# EAGLE design BoardA2 (EAGLE 8.2.1)
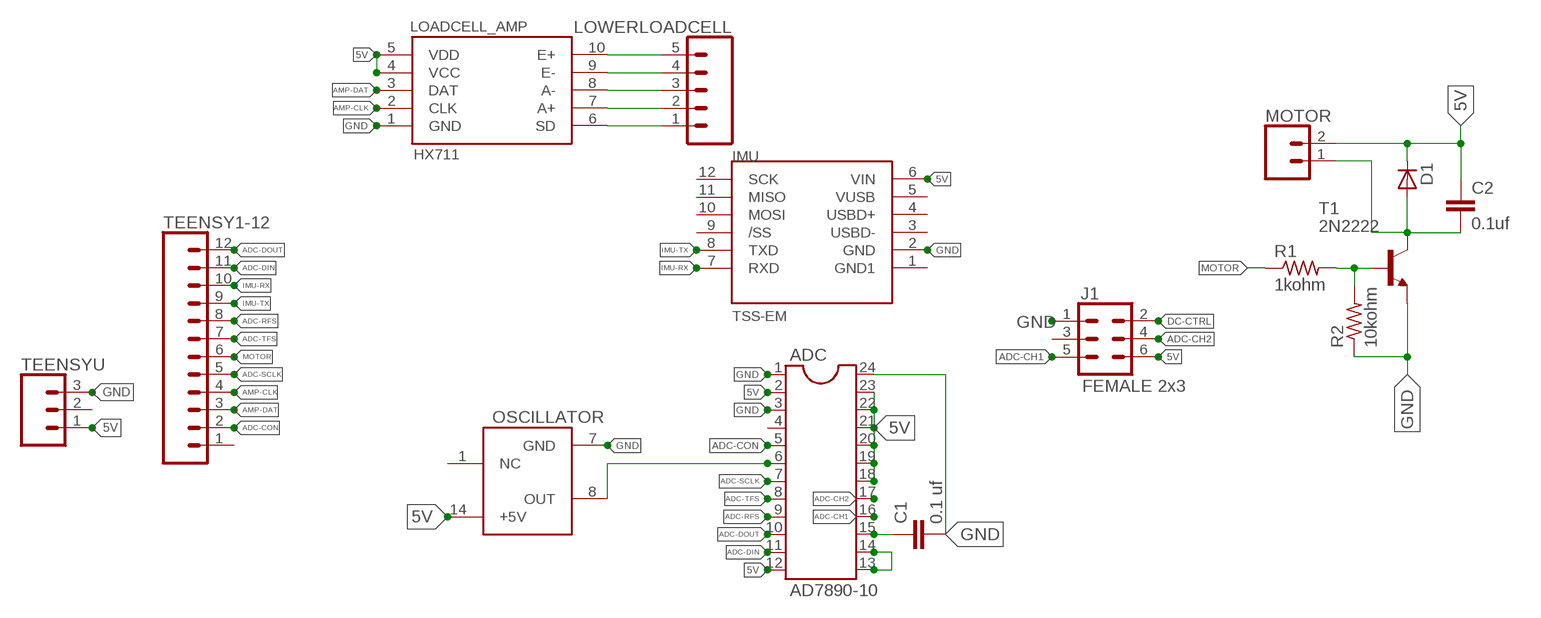
[diagram p0: schematic, sheet 1]

## Parts
ADC  AD7890-10  DIL24-3  [DIL24-3]
C1  0.1 uf  C5/2.5  [C5B2.5]
C2  0.1uf  C5/2.5  [C5B2.5]
D1  DIODE_E-DO35-7  [DIODE_DO35-7]
IMU  TSS-EM  IMU  [IMU]
J1  FEMALE 2x3  CONN_03X2FEMALE  [2X3]
LOADCELL_AMP  HX711  LOADCELLAMP  [LOADCELLAMP2]
LOWERLOADCELL  CONN_05  [1X05]
MOTOR  CONN_02  [1X02]
OSCILLATOR  CLOCK-ECS-100X  [ECS-100X]
R1  1kohm  R-US_0204/5  [0204/5]
R2  10kohm  R-US_0204/5  [0204/5]
T1  2N2222  [TO18]
TEENSY1-12  CONN_12  [1X12]
TEENSYU  CONN_03  [1X03]

## Nets
5V: ADC.2 ADC.12 ADC.18 ADC.19 ADC.20 ADC.21 ADC.22 ADC.23 C2.1 D1.C(A) IMU.6(VIN) J1.6 LOADCELL_AMP.4(VCC) LOADCELL_AMP.5(VDD) MOTOR.2 OSCILLATOR.14(+5V) TEENSYU.1
ADC-CH1: ADC.16 J1.5
ADC-CH2: ADC.17 J1.4
ADC-CLK: ADC.6 OSCILLATOR.8(OUT)
ADC-CON: ADC.5 TEENSY1-12.2
ADC-DIN: ADC.11 TEENSY1-12.11
ADC-DOUT: ADC.10 TEENSY1-12.12
ADC-RFS: ADC.9 TEENSY1-12.8
ADC-SCLK: ADC.7 TEENSY1-12.5
ADC-TFS: ADC.8 TEENSY1-12.7
AMP-A+: LOADCELL_AMP.7(A+) LOWERLOADCELL.2
AMP-A-: LOADCELL_AMP.8(A-) LOWERLOADCELL.3
AMP-CLK: LOADCELL_AMP.2(CLK) TEENSY1-12.4
AMP-DAT: LOADCELL_AMP.3(DAT) TEENSY1-12.3
AMP-E+: LOADCELL_AMP.10(E+) LOWERLOADCELL.5
AMP-E-: LOADCELL_AMP.9(E-) LOWERLOADCELL.4
AMP-SD: LOADCELL_AMP.6(SD) LOWERLOADCELL.1
DC-CTRL: J1.2
GND [powers]: ADC.1 ADC.3 ADC.24 C1.2 IMU.2(GND) J1.1 LOADCELL_AMP.1(GND) OSCILLATOR.7(GND) R2.1 T1.1(E) TEENSYU.3
IMU-RX: IMU.7(RXD) TEENSY1-12.10
IMU-TX: IMU.8(TXD) TEENSY1-12.9
MOTOR: R1.1 TEENSY1-12.6
N$1: ADC.13 ADC.14
N$3: ADC.15 C1.1
N$6: C2.2 D1.A(C) MOTOR.1 T1.3(C)
N$8: R1.2 R2.2 T1.2(B)
Unconnected: ADC.4 IMU.1(GND1) IMU.3(USBD-) IMU.4(USBD+) IMU.5(VUSB) IMU.9(/SS) IMU.10(MOSI) IMU.11(MISO) IMU.12(SCK) J1.3 OSCILLATOR.1(NC) TEENSY1-12.1 TEENSYU.2

## Library data of the parts
ADC = Smartcrutches:DIL24: Dual In Line
C1 C2 = capacitor-wima:C: CAPACITOR naming: grid - package width
D1 = eagle-ltspice:DIODE_E-: Schottky Diode; SPICEMODEL: diode; SPICEPREFIX: D
IMU = Smartcrutches:IMU
J1 = SparkFun-Connectors:CONN_03X2: Multi connection point. Often used as Generic Header-pin footprint for 0.1 inch spaced/style header connections You can populate with any combo of single row headers, but if you'd like an exact match, check these: Header - 2x3 (Male, 0.1") <https://www.sparkfun.com/products/12807> (PRT-12807) Header - 2x3 (Female, 0.1") <https://www.sparkfun.com/products/13010> (PRT-13010) 2x3 Pin Shrouded Header <https://www.sparkfun.com/products/10877> (PRT-10877) On any of the 0.1 inch spaced packages, you can populate with these: Break Away Headers - Straight <https://www.sparkfun.com/products/116> (PRT-00116) Break Away Male Headers - Right Angle <https://www.sparkfun.com/products/553> (PRT-00553) Female Headers <https://www.sparkfun.com/products/115> (PRT-00115) Break Away Headers - Machine Pin <https://www.sparkfun.com/products/117> (PRT-00117) Break Away Female Headers - Swiss Machine Pin <https://www.sparkfun.com/products/743> (PRT-00743) Special note: the shrouded connector mates well with our 3x2 ribbon cables: Ribbon Crimp Connector - 6-pin (2x3, Female) <https://www.sparkfun.com/products/10651> (PRT-10651) Ribbon Cable - 6 wire (15ft) <https://www.sparkfun.com/products/10646> (PRT-10646); PROD_ID: CONN-11566
LOADCELL_AMP = Smartcrutches:LOADCELLAMP
LOWERLOADCELL = SparkFun-Connectors:CONN_05: Multi connection point. Often used as Generic Header-pin footprint for 0.1 inch spaced/style header connections On any of the 0.1 inch spaced packages, you can populate with these: Break Away Headers - Straight <https://www.sparkfun.com/products/116> (PRT-00116) Break Away Male Headers - Right Angle <https://www.sparkfun.com/products/553> (PRT-00553) Female Headers <https://www.sparkfun.com/products/115> (PRT-00115) Break Away Headers - Machine Pin <https://www.sparkfun.com/products/117> (PRT-00117) Break Away Female Headers - Swiss Machine Pin <https://www.sparkfun.com/products/743> (PRT-00743) For SCREWTERMINALS and SPRING TERMINALS visit here: Screw Terimnals on SparkFun.com <https://www.sparkfun.com/search/results?term=Screw+Terminals> (5mm/3.5mm/2.54mm spacing) This device is also useful as a general connection point to wire up your design to another part of your project. Our various solder wires solder well into these plated through hole pads. Hook-Up Wire - Assortment (Stranded, 22 AWG) <https://www.sparkfun.com/products/11375> (PRT-11375) Hook-Up Wire - Assortment (Solid Core, 22 AWG) <https://www.sparkfun.com/products/11367> (PRT-11367) View the entire wire category on our website here <https://www.sparkfun.com/categories/141> Special notes: Molex polarized connector foot print use with SKU : PRT-08231 with associated crimp pins and housings. 1MM SMD Version SKU: PRT-10208
MOTOR = SparkFun-Connectors:CONN_02: Multi connection point. Often used as Generic Header-pin footprint for 0.1 inch spaced/style header connections On any of the 0.1 inch spaced packages, you can populate with these: Break Away Headers - Straight <https://www.sparkfun.com/products/116> (PRT-00116) Break Away Male Headers - Right Angle <https://www.sparkfun.com/products/553> (PRT-00553) Female Headers <https://www.sparkfun.com/products/115> (PRT-00115) Break Away Headers - Machine Pin <https://www.sparkfun.com/products/117> (PRT-00117) Break Away Female Headers - Swiss Machine Pin <https://www.sparkfun.com/products/743> (PRT-00743) For SCREWTERMINALS and SPRING TERMINALS visit here: Screw Terimnals on SparkFun.com <https://www.sparkfun.com/search/results?term=Screw+Terminals> (5mm/3.5mm/2.54mm spacing) This device is also useful as a general connection point to wire up your design to another part of your project. Our various solder wires solder well into these plated through hole pads. Hook-Up Wire - Assortment (Stranded, 22 AWG) <https://www.sparkfun.com/products/11375> (PRT-11375) Hook-Up Wire - Assortment (Solid Core, 22 AWG) <https://www.sparkfun.com/products/11367> (PRT-11367) View the entire wire category on our website here <https://www.sparkfun.com/categories/141> Special notes: Molex polarized connector foot print use with: PRT-08233 with associated crimp pins and housings. 2.54_SCREWTERM for use with PRT-10571. 3.5mm Screw Terminal footprints for PRT-08084 5mm Screw Terminal footprints for use with PRT-08432
OSCILLATOR = Smartcrutches:CLOCK-ECS-100X: Clock Oscillator : ESC-100AX-020
R1 R2 = resistor:R-US_: RESISTOR, American symbol
T1 = transistor:2N2222: NPN TRANSISTOR
TEENSY1-12 = SparkFun-Connectors:CONN_12: Multi connection point. Often used as Generic Header-pin footprint for 0.1 inch spaced/style header connections On any of the 0.1 inch spaced packages, you can populate with these: Break Away Headers - Straight <https://www.sparkfun.com/products/116> (PRT-00116) Break Away Male Headers - Right Angle <https://www.sparkfun.com/products/553> (PRT-00553) Female Headers <https://www.sparkfun.com/products/115> (PRT-00115) Break Away Headers - Machine Pin <https://www.sparkfun.com/products/117> (PRT-00117) Break Away Female Headers - Swiss Machine Pin <https://www.sparkfun.com/products/743> (PRT-00743) For SCREWTERMINALS and SPRING TERMINALS visit here: Screw Terimnals on SparkFun.com <https://www.sparkfun.com/search/results?term=Screw+Terminals> (5mm/3.5mm/2.54mm spacing) This device is also useful as a general connection point to wire up your design to another part of your project. Our various solder wires solder well into these plated through hole pads. Hook-Up Wire - Assortment (Stranded, 22 AWG) <https://www.sparkfun.com/products/11375> (PRT-11375) Hook-Up Wire - Assortment (Solid Core, 22 AWG) <https://www.sparkfun.com/products/11367> (PRT-11367) View the entire wire category on our website here <https://www.sparkfun.com/categories/141> Special notes: Molex polarized connector foot print use with SKU : PRT-08231 with associated crimp pins and housings. 1MM SMD Version SKU: PRT-10208 NOTES ON THE VARIANTS LOCK and LOCK_LONGPADS... This footprint was designed to help hold the alignment of a through-hole component (i.e. 6-pin header) while soldering it into place. You may notice that each hole has been shifted either up or down by 0.005 of an inch from it's more standard position (which is a perfectly straight line). This slight alteration caused the pins (the squares in the middle) to touch the edges of the holes. Because they are alternating, it causes a "brace" to hold the component in place. 0.005 has proven to be the perfect amount of "off-center" position when using our standard breakaway headers. Although looks a little odd when you look at the bare footprint, once you have a header in there, the alteration is very hard to notice. Also,if you push a header all the way into place, it is covered up entirely on the bottom side.
TEENSYU = SparkFun-Connectors:CONN_03: Multi connection point. Often used as Generic Header-pin footprint for 0.1 inch spaced/style header connections On any of the 0.1 inch spaced packages, you can populate with these: Break Away Headers - Straight <https://www.sparkfun.com/products/116> (PRT-00116) Break Away Male Headers - Right Angle <https://www.sparkfun.com/products/553> (PRT-00553) Female Headers <https://www.sparkfun.com/products/115> (PRT-00115) Break Away Headers - Machine Pin <https://www.sparkfun.com/products/117> (PRT-00117) Break Away Female Headers - Swiss Machine Pin <https://www.sparkfun.com/products/743> (PRT-00743) Stackable Header - 3 Pin (Female, 0.1") <https://www.sparkfun.com/products/13875> (PRT-13875) For SCREWTERMINALS and SPRING TERMINALS visit here: Screw Terimnals on SparkFun.com <https://www.sparkfun.com/search/results?term=Screw+Terminals> (5mm/3.5mm/2.54mm spacing) This device is also useful as a general connection point to wire up your design to another part of your project. Our various solder wires solder well into these plated through hole pads. Hook-Up Wire - Assortment (Stranded, 22 AWG) <https://www.sparkfun.com/products/11375> (PRT-11375) Hook-Up Wire - Assortment (Solid Core, 22 AWG) <https://www.sparkfun.com/products/11367> (PRT-11367) View the entire wire category on our website here <https://www.sparkfun.com/categories/141> Special notes: Molex polarized connector foot print use with SKU : PRT-08232 with associated crimp pins and housings.

## Net classes
1 signals: width 1.27 mm
2 powers: width 1.778 mm

## Board
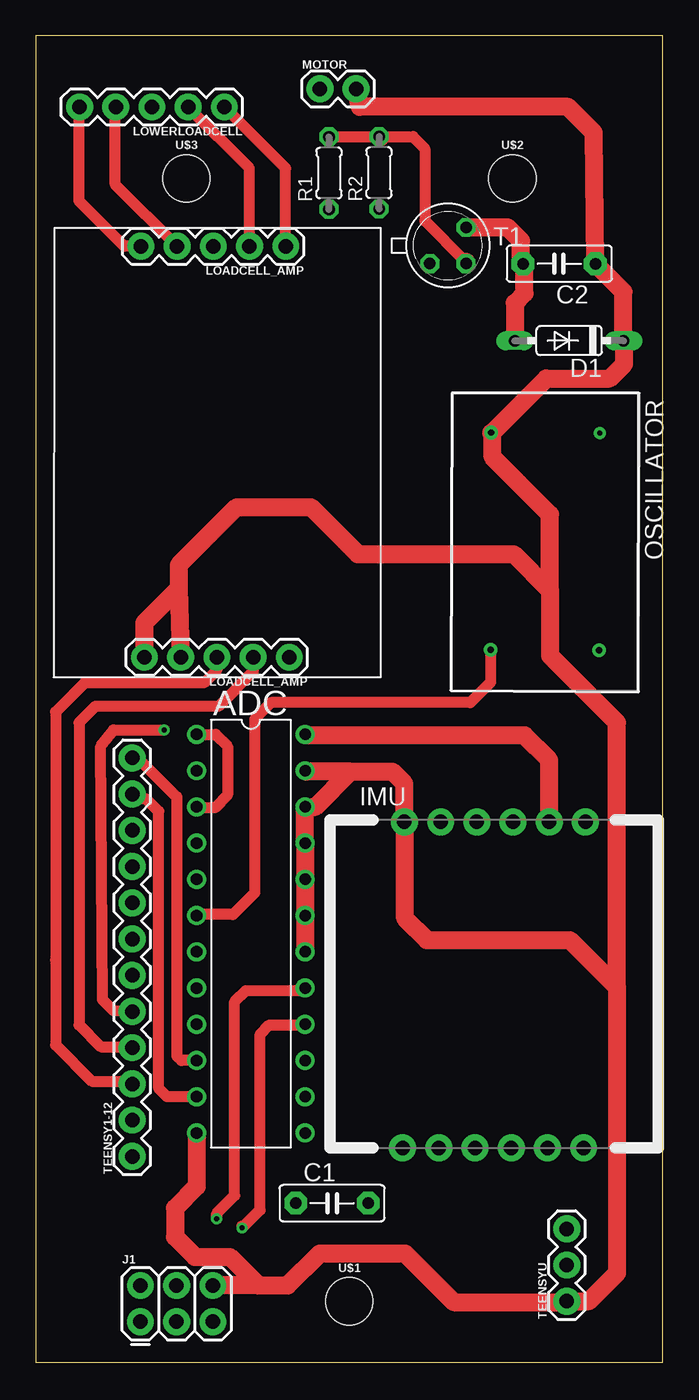
[diagram p1: board, top side]
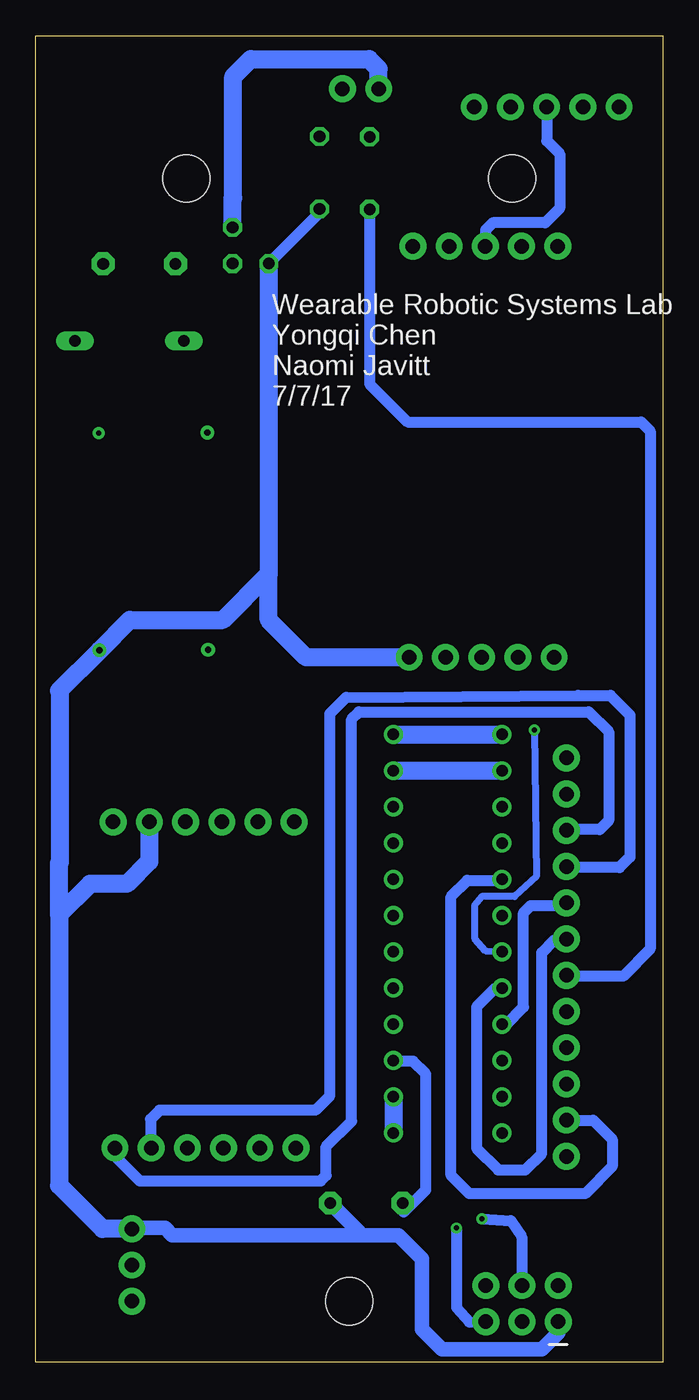
[diagram p2: board, bottom side, seen from below]

Size 44 x 93 mm. Coordinates in mm from the lower left corner, seen from the top.
Outline: 0,0 44,0 44,93 0,93 0,0
Copper layers (1*16): Top 0.035mm / dielectric 1.5mm / Bottom 0.035mm
Design rules "pentalogix": minimum track width 5mil, minimum drill 8mil, track to track 5mil, track to pad 5mil, pad to pad 5mil, via to via 5mil, smd to smd 5mil, copper to edge 12mil, drill to drill 6mil, minimum pad ring 10mil, minimum via ring 8mil, stop-mask expansion 4mil, vias tented up to drill 0mil, thermal gap 10mil

### Footprints (pad centres in the part's own frame; a part is rotated, then mirrored left to right if it is on the bottom)
DIL24-3 = drill 0.813: 1 -13.97,-3.81; 2 -11.43,-3.81; 3 -8.89,-3.81; 4 -6.35,-3.81; 5 -3.81,-3.81; 6 -1.27,-3.81; 7 1.27,-3.81; 8 3.81,-3.81; 9 6.35,-3.81; 10 8.89,-3.81; 11 11.43,-3.81; 12 13.97,-3.81; 13 13.97,3.81; 14 11.43,3.81; 15 8.89,3.81; 16 6.35,3.81; 17 3.81,3.81; 18 1.27,3.81; 19 -1.27,3.81; 20 -3.81,3.81; 21 -6.35,3.81; 22 -8.89,3.81; 23 -11.43,3.81; 24 -13.97,3.81
C5B2.5 = drill 0.813 pad 1.6 octagon: 1 -2.54,0; 2 2.54,0
DIODE_DO35-7 = drill 0.813 long: A 3.81,0; C -3.81,0
IMU = drill 1.016 pad 1.88: 1 22.86,-17.907; 2 22.86,-15.367; 3 22.86,-12.827; 4 22.86,-10.287; 5 22.86,-7.747; 6 22.86,-5.207; 7 0,-17.78; 8 0,-15.24; 9 0,-12.7; 10 0,-10.16; 11 0,-7.62; 12 0,-5.08
2X3 = drill 1.016 pad 1.88: 1 0,0; 2 0,2.54; 3 2.54,0; 4 2.54,2.54; 5 5.08,0; 6 5.08,2.54
LOADCELLAMP2 = drill 1.016 pad 1.88: 1 -14.605,-5.08; 2 -14.605,-2.54; 3 -14.605,0; 4 -14.605,2.54; 5 -14.605,5.08; 6 14.213,-4.826; 7 14.213,-2.286; 8 14.213,0.254; 9 14.213,2.794; 10 14.213,5.334
1X05 = drill 1.016 pad 1.88: 1 0,0; 2 2.54,0; 3 5.08,0; 4 7.62,0; 5 10.16,0
1X02 = drill 1.016 pad 1.88: 1 0,0; 2 2.54,0
ECS-100X = drill 0.35: 1 -7.62,3.81 | drill 0.45: 7 7.62,3.81; 8 7.61,-3.81; 14 -7.62,-3.81
0204/5 = drill 0.813 octagon: 1 -2.54,0; 2 2.54,0
TO18 = drill 0.813 octagon: 1 -1.27,-1.27; 2 1.27,-1.27; 3 1.27,1.27
1X12 = drill 1.016 pad 1.88: 1 0,0; 2 2.54,0; 3 5.08,0; 4 7.62,0; 5 10.16,0; 6 12.7,0; 7 15.24,0; 8 17.78,0; 9 20.32,0; 10 22.86,0; 11 25.4,0; 12 27.94,0
1X03 = drill 1.016 pad 1.88: 1 0,0; 2 2.54,0; 3 5.08,0
STAND-OFF = hole 3.302: 0,0

### Placement (x,y rotation side)
ADC  15.1,30.04 270 top
C1  20.79,11.14 0 top
C2  36.73,77.01 180 top
D1  37.42,71.61 180 top
IMU  20.66,15.01 90 top
J1  7.35,2.83 0 top
LOADCELL_AMP  12.71,64.02 90 top
LOWERLOADCELL  13.24,88 180 top
MOTOR  19.94,89.27 0 top
OSCILLATOR  35.74,57.53 269.8 top
R1  20.57,83.37 90 top
R2  24.09,83.39 90 top
T1  28.92,78.29 0 top
TEENSY1-12  6.77,14.42 90 top
TEENSYU  37.25,4.26 90 top
U$1  [STAND-OFF]  22.01,4.26 0 top
U$2  [STAND-OFF]  33.44,83 0 top
U$3  [STAND-OFF]  10.58,83 0 top

### Tracks (layer width: path | path; a pad name or v marks a point on that pad's centre or on a via)
5V
  Top 1.27: ADC.18 ADC.19 ADC.20 ADC.21 ADC.22 19.62,38.92 22.1,41.4 | ADC.12 11.3,12.7 11.3,12.32 9.78,10.79 9.78,8.76 11.18,7.37 13.62,7.37 15.62,5.37 | 12.57,5.51 J1.6 15.62,5.37 | MOTOR.2 22.74,88.01 37.34,88.01 39.14,86.21 C2.1 41.23,75.04 D1.C 41.27,71.57 41.27,69.98 40.26,68.96 35.81,68.96 32.02,65.17 | 32.02,65.17 OSCILLATOR.14 | 15.62,5.37 17.68,5.37 19.94,7.62 25.91,7.62 29.34,4.19 37.18,4.19 TEENSYU.1 38.8,4.26 40.77,6.22 40.77,26.29 | 40.77,26.29 40.77,44.83 36.07,49.53 36.07,54.1 | 36.07,54.1 36.07,59.44 32.05,63.45 32.05,65.14 32.02,65.17 | 10.03,54.23 10.03,55.88 14.1,59.94 19.3,59.94 22.61,56.64 33.53,56.64 36.07,54.1 | 10.03,54.23 7.62,51.82 7.62,49.43 LOADCELL_AMP.5 | 10.03,54.23 10.16,49.55 LOADCELL_AMP.4 | 22.1,41.4 25.02,41.4 25.86,40.56 IMU.6 25.91,37.83 25.91,31.11 27.43,29.59 37.47,29.59 40.77,26.29 | 22.1,41.4 18.97,41.4 ADC.23
  Bottom 1.27: ADC.23 ADC.2
ADC-CH1  (via drill 0.35)
  Top 0.762: 14.48,9.53 v14.48,9.4 15.75,10.67 15.75,22.99 16.38,23.62 18.84,23.62 ADC.16
  Bottom 0.762: v14.48,9.4 14.48,3.81 13.59,2.79 J1.5
ADC-CH2  (via drill 0.35)
  Top 0.762: 12.7,10.16 v12.7,10.03 12.7,10.41 13.97,11.68 13.97,25.27 14.73,26.04 18.72,26.04 ADC.17
  Bottom 0.762: v12.7,10.03 10.67,9.91 9.91,8.76 J1.4
ADC-CLK
  Top 0.762: ADC.6 11.35,31.37 13.84,31.37 15.37,32.89 15.37,45.09 16.51,46.23 30.48,46.23 31.91,47.65 OSCILLATOR.8
ADC-CON
  Bottom 0.762: TEENSY1-12.2 4.89,16.96 3.56,15.62 3.56,13.72 5.46,11.81 13.59,11.81 14.86,13.08 14.86,32.64 13.72,33.78 11.35,33.78 ADC.5
ADC-DIN
  Top 0.762: ADC.11 9.21,18.61 8.64,19.18 8.64,38.61 7.75,39.5 7.09,39.5 TEENSY1-12.11
ADC-DOUT
  Top 0.762: ADC.10 10.22,21.14 9.91,21.46 9.91,39.62 7.17,42.36 TEENSY1-12.12
ADC-RFS
  Bottom 0.762: ADC.9 10.99,23.68 9.78,24.89 9.78,31.5 9.27,32 6.97,32 TEENSY1-12.8
ADC-SCLK  (via drill 0.35)
  Top 0.762: TEENSY1-12.5 5.46,24.64 4.7,25.4 4.57,43.18 5.46,44.32 v9.02,44.32
  Bottom 0.508: v9.02,44.32 8.89,34.04 10.41,32.64 12.7,32.64 13.21,32 13.21,29.72 12.45,28.83 ADC.7
ADC-TFS
  Bottom 0.762: ADC.8 11.75,26.23 13.08,24.89 13.08,14.99 11.56,13.46 9.65,13.46 8.51,14.61 8.51,28.7 7.62,29.59 6.84,29.59 TEENSY1-12.7
AMP-A+
  Top 0.762: LOADCELL_AMP.7 15,83.7 LOWERLOADCELL.2
AMP-A-
  Bottom 0.762: LOWERLOADCELL.3 8.16,85.63 7.24,84.71 7.24,80.9 8.26,79.88 11.94,79.88 12.45,79.38 12.45,78.24 LOADCELL_AMP.8
AMP-CLK
  Top 0.762: LOADCELL_AMP.2 15.25,48.4 12.83,45.97 4.19,45.97 3.05,44.83 3.05,23.62 4.57,22.1 6.71,22.1 TEENSY1-12.4
AMP-DAT
  Top 0.508: TEENSY1-12.3 6.46,19.81
  Top 0.762: LOADCELL_AMP.3 12.71,48.53 11.81,47.62 3.43,47.62 1.4,45.59 1.4,28.19 1.4,22.23 3.94,19.68 6.58,19.68 TEENSY1-12.3
AMP-E+
  Top 0.762: LOADCELL_AMP.10 6.22,78.23 3.05,81.41 3.05,87.97 LOWERLOADCELL.5
AMP-E-
  Top 0.762: LOADCELL_AMP.9 9.91,78.23 5.59,82.55 5.59,87.97 LOWERLOADCELL.4
AMP-SD
  Top 0.762: LOADCELL_AMP.6 17.54,83.7 LOWERLOADCELL.1
GND
  Top 0.762: ADC.1 12.64,44.01 13.46,43.18 13.46,39.75 12.57,38.86 11.35,38.86 ADC.3
  Top 1.27: IMU.2 36.02,42.21 34.29,43.94 18.97,43.94 ADC.24
  Bottom 0.762: R2.1 24.09,80.58 T1.1
  Bottom 1.016: J1.1 7.35,2.05 8.51,0.89 15.49,0.89 16.89,2.29 16.89,7.24 18.54,8.89 21.34,8.89 | 21.34,8.89 34.42,8.89 34.92,9.4 37.19,9.4 TEENSYU.3 | 21.34,8.89 21.34,9.14 C1.2
  Bottom 1.27: TEENSYU.3 39.31,9.34 42.35,12.38 42.35,31.37 | ADC.24 ADC.1 | IMU.2 36.02,35.09 37.59,33.53 40.19,33.53 42.35,31.37 | T1.1 27.65,55.24 | 27.65,55.24 27.65,52.03 25.02,49.4 17.8,49.4 LOADCELL_AMP.1 | 27.65,55.24 30.86,52.03 37.39,52.03 OSCILLATOR.7 42.35,47.08 42.29,47.02 42.29,35.05 42.35,34.99 42.35,31.37
IMU-RX
  Bottom 0.762: IMU.7 38.44,14.44 36.7,12.7 24,12.7 23.62,13.08 23.62,15.11 21.84,16.89 21.84,45.09 21.34,45.59 5.21,45.59 3.81,44.2 3.81,37.97 4.45,37.34 6.71,37.34 TEENSY1-12.10
IMU-TX
  Bottom 0.762: TEENSY1-12.9 6.7,34.67 3.05,34.67 2.31,35.41 2.31,45.36 3.68,46.74 5.97,46.74 22.23,46.61 23.37,45.47 23.37,18.67 24.38,17.65 35.31,17.65 35.94,17.02 35.94,15.05 IMU.8
MOTOR
  Bottom 0.762: TEENSY1-12.6 6.7,27.05 2.79,27.05 0.89,28.96 0.89,65.28 1.52,65.91 17.91,65.91 20.57,68.58 R1.1
N$1
  Bottom 1.27: ADC.14 ADC.13
N$3
  Bottom 0.762: C1.1 18.2,10.51 16.64,12.06 16.64,20.19 17.53,21.08 18.84,21.08 ADC.15
N$6
  Top 1.27: T1.3 33.09,79.56 34.04,78.61 34.04,77.16 C2.2 34.29,76.91 34.29,74.93 33.61,74.25 D1.A
  Bottom 1.27: MOTOR.1 19.94,90.68 20.61,91.35 28.92,91.35 30.14,90.13 30.14,81.63 30.19,81.58 T1.3
N$8
  Top 0.762: 30.19,77.13 27.3,80.01 27.3,85.09 26.46,85.93 R2.2 24.06,85.91 R1.2
  Top 1.27: T1.2 30.19,77.13 | 24.16,85.85 R2.2 | 20.6,85.93 R1.2

### Text on the board
_bsilk: Wearable Robotic Systems Lab / Yongqi Chen / Naomi Javitt / 7/7/17